# Altium project SmartMCU.PrjPcb
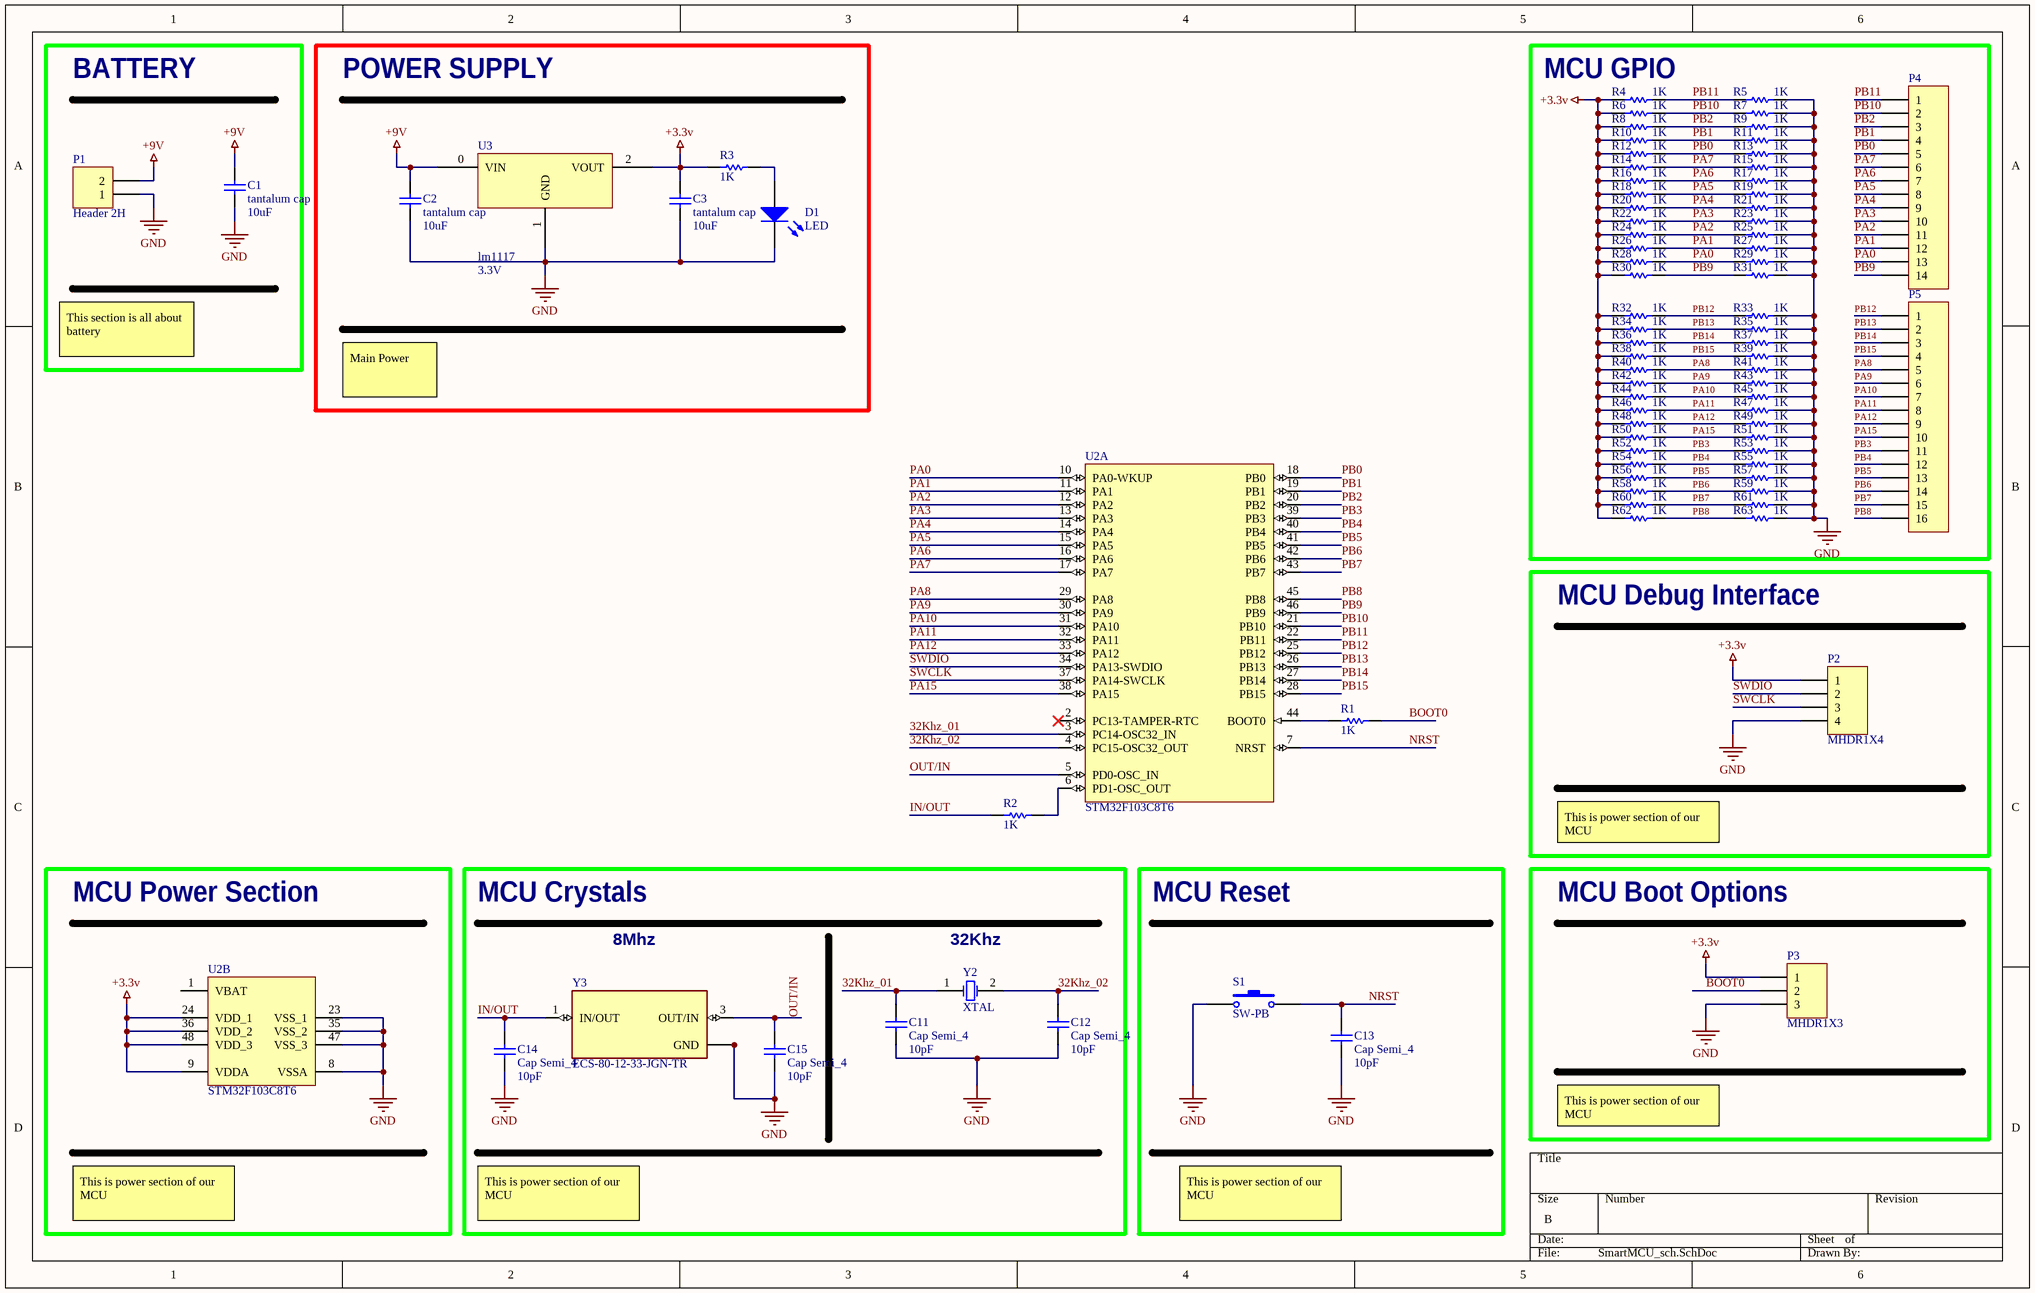
[diagram p0: SmartMCU_sch.SchDoc]

3 sheets, 89 parts. Net scope: global (net labels, ports and power ports of the same name join across sheets).
Board file: SmartMCU_PCB.PcbDoc
Sheets:
  SmartMCU_sch.SchDoc
  MCU.SchDoc
  PowerSupply.SchDoc

## Sheet SmartMCU_sch.SchDoc
size B; SheetNumber: 1; SheetTotal: 3; SPICEModelCacheFSFVQVPL: <root> / <DocumentId>FSFVQVPL</DocumentId> / </root>

### Parts
C1  tantalum cap  value 10uF  [C1206tancap]
C2  tantalum cap  value 10uF  [C1206tancap]
C3  tantalum cap  value 10uF  [C1206tancap]
C11  Cap Semi_4  value 10pF  [0402cap]
C12  Cap Semi_4  value 10pF  [0402cap]
C13  Cap Semi_4  value 10pF  [0402cap]
C14  Cap Semi_4  value 10pF  [0402cap]
C15  Cap Semi_4  value 10pF  [0402cap]
D1  LED  [MY_LED_0805]
P1  Header 2H  [HDR1X2H]
P2  MHDR1X4  [MHDR1X4body]
P3  MHDR1X3  [MHDR1X3body]
P4  Header 14  [My_1X14]  (value not drawn)
P5  Header 16  [My_1X16]  (value not drawn)
R1  1K  [MY_0603]
R2  1K  [MY_0402]
R3  1K  [MY_0805]
R4  1K  [MY_0603]
R5  1K  [MY_0603]
R6  1K  [MY_0603]
R7  1K  [MY_0603]
R8  1K  [MY_0603]
R9  1K  [MY_0603]
R10  1K  [MY_0603]
R11  1K  [MY_0603]
R12  1K  [MY_0603]
R13  1K  [MY_0603]
R14  1K  [MY_0603]
R15  1K  [MY_0603]
R16  1K  [MY_0603]
R17  1K  [MY_0603]
R18  1K  [MY_0603]
R19  1K  [MY_0603]
R20  1K  [MY_0603]
R21  1K  [MY_0603]
R22  1K  [MY_0603]
R23  1K  [MY_0603]
R24  1K  [MY_0603]
R25  1K  [MY_0603]
R26  1K  [MY_0603]
R27  1K  [MY_0603]
R28  1K  [MY_0603]
R29  1K  [MY_0603]
R30  1K  [MY_0603]
R31  1K  [MY_0603]
R32  1K  [MY_0603]
R33  1K  [MY_0603]
R34  1K  [MY_0603]
R35  1K  [MY_0603]
R36  1K  [MY_0603]
R37  1K  [MY_0603]
R38  1K  [MY_0603]
R39  1K  [MY_0603]
R40  1K  [MY_0603]
R41  1K  [MY_0603]
R42  1K  [MY_0603]
R43  1K  [MY_0603]
R44  1K  [MY_0603]
R45  1K  [MY_0603]
R46  1K  [MY_0603]
R47  1K  [MY_0603]
R48  1K  [MY_0603]
R49  1K  [MY_0603]
R50  1K  [MY_0603]
R51  1K  [MY_0603]
R52  1K  [MY_0603]
R53  1K  [MY_0603]
R54  1K  [MY_0603]
R55  1K  [MY_0603]
R56  1K  [MY_0603]
R57  1K  [MY_0603]
R58  1K  [MY_0603]
R59  1K  [MY_0603]
R60  1K  [MY_0603]
R61  1K  [MY_0603]
R62  1K  [MY_0603]
R63  1K  [MY_0603]
S1  SW-PB  [SPST-2_body]
U2  STM32F103C8T6  [STM-LQFP48_L]  (parts A,B of 2)
U3  lm1117  output voltag: 3.3V  [4-Pin SOT]
Y2  XTAL  [32768]
Y3  ECS-80-12-33-JGN-TR  [8MHZCrystall]

### Blocks framed on the sheet
BATTERY: C1 P1
POWER SUPPLY: C2 C3 D1 R3 U3
MCU GPIO: P4 P5 R4-R63
MCU Debug Interface: P2
MCU Power Section: U2
MCU Crystals: C11 C12 C14 C15 Y2 Y3
MCU Reset: C13 S1
MCU Boot Options: P3

### Nets
+3.3v: C3.2 P2.1 P3.1 R3.1 R4.1 R6.1 R8.1 R10.1 R12.1 R14.1 R16.1 R18.1 R20.1 R22.1 R24.1 R26.1 R28.1 R30.1 R32.1 R34.1 R36.1 R38.1 R40.1 R42.1 R44.1 R46.1 R48.1 R50.1 R52.1 R54.1 R56.1 R58.1 R60.1 R62.1 U2.9(VDDA) U2.24(VDD_1) U2.36(VDD_2) U2.48(VDD_3) U3.2(VOUT)
+9V: C1.2 C2.2 P1.2 U3.0(VIN)
GND: C1.1 C2.1 C3.1 C11.2 C12.2 C13.1 C14.2 C15.2 D1.K P1.1 P2.4 P3.3 R5.2 R7.2 R9.2 R11.2 R13.2 R15.2 R17.2 R19.2 R21.2 R23.2 R25.2 R27.2 R29.2 R31.2 R33.2 R35.2 R37.2 R39.2 R41.2 R43.2 R45.2 R47.2 R49.2 R51.2 R53.2 R55.2 R57.2 R59.2 R61.2 R63.2 S1.1 U2.8(VSSA) U2.23(VSS_1) U2.35(VSS_2) U2.47(VSS_3) U3.1(GND) Y3.2(GND) Y3.4(GND)
32Khz_01: C11.1 U2.3(PC14-OSC32_IN) Y2.1(OSC1)
32Khz_02: C12.1 U2.4(PC15-OSC32_OUT) Y2.2(OSC2)
BOOT0: P3.2 R1.2
IN/OUT: C14.1 R2.1 Y3.1(IN/OUT)
NRST: C13.2 S1.2 U2.7(NRST)
OUT/IN: C15.1 U2.5(PD0-OSC_IN) Y3.3(OUT/IN)
PA0: P4.13 R28.2 R29.1 U2.10(PA0-WKUP)
PA1: P4.12 R26.2 R27.1 U2.11(PA1)
PA2: P4.11 R24.2 R25.1 U2.12(PA2)
PA3: P4.10 R22.2 R23.1 U2.13(PA3)
PA4: P4.9 R20.2 R21.1 U2.14(PA4)
PA5: P4.8 R18.2 R19.1 U2.15(PA5)
PA6: P4.7 R16.2 R17.1 U2.16(PA6)
PA7: P4.6 R14.2 R15.1 U2.17(PA7)
PA8: P5.5 R40.2 R41.1 U2.29(PA8)
PA9: P5.6 R42.2 R43.1 U2.30(PA9)
PA10: P5.7 R44.2 R45.1 U2.31(PA10)
PA11: P5.8 R46.2 R47.1 U2.32(PA11)
PA12: P5.9 R48.2 R49.1 U2.33(PA12)
PA15: P5.10 R50.2 R51.1 U2.38(PA15)
PB0: P4.5 R12.2 R13.1 U2.18(PB0)
PB1: P4.4 R10.2 R11.1 U2.19(PB1)
PB2: P4.3 R8.2 R9.1 U2.20(PB2)
PB3: P5.11 R52.2 R53.1 U2.39(PB3)
PB4: P5.12 R54.2 R55.1 U2.40(PB4)
PB5: P5.13 R56.2 R57.1 U2.41(PB5)
PB6: P5.14 R58.2 R59.1 U2.42(PB6)
PB7: P5.15 R60.2 R61.1 U2.43(PB7)
PB8: P5.16 R62.2 R63.1 U2.45(PB8)
PB9: P4.14 R30.2 R31.1 U2.46(PB9)
PB10: P4.2 R6.2 R7.1 U2.21(PB10)
PB11: P4.1 R4.2 R5.1 U2.22(PB11)
PB12: P5.1 R32.2 R33.1 U2.25(PB12)
PB13: P5.2 R34.2 R35.1 U2.26(PB13)
PB14: P5.3 R36.2 R37.1 U2.27(PB14)
PB15: P5.4 R38.2 R39.1 U2.28(PB15)
SWCLK: P2.3 U2.37(PA14-SWCLK)
SWDIO: P2.2 U2.34(PA13-SWDIO)
NetD1_A: D1.A R3.2
NetR1_1: R1.1 U2.44(BOOT0)
NetR2_2: R2.2 U2.6(PD1-OSC_OUT)

Not connected (* = marked no-connect by the designer): U2 1(VBAT) 2(PC13-TAMPER-RTC)*

### Notes on the sheet
- This section is all about battery
- Main Power
- This is power section of our MCU
- 8Mhz
- (near Y2) 32Khz

### Library data of the parts
C1-C3 = Cap Semi_5: Capacitor (Semiconductor SIM Model); Published: 8-Jun-2000; LatestRevisionDate: 29-May-2009; LatestRevisionNote: IPC-7351 Footprint Added.; PackageReference: C1206; Publisher: Altium Limited; PackageDescription: Chip Capacitor
C11-C15 = Cap Semi_4: Capacitor (Semiconductor SIM Model); Published: 8-Jun-2000; LatestRevisionDate: 29-May-2009; LatestRevisionNote: IPC-7351 Footprint Added.; PackageReference: C1206; Publisher: Altium Limited; PackageDescription: Chip Capacitor
D1 = LED: Typical INFRARED GaAs LED; ASiD Part Number: LED-AS
P1 = Header 2H: Header, 2-Pin, Right Angle; Voltage: 9V; LatestRevisionDate: 17-Jul-2002; LatestRevisionNote: Re-released for DXP Platform.; Publisher: Altium Limited
P2 = MHDR1X4: Header, 4-Pin; LatestRevisionDate: 17-Jul-2002; LatestRevisionNote: Re-released for DXP Platform.; Publisher: Altium Limited
P3 = MHDR1X3: Header, 3-Pin; LatestRevisionDate: 17-Jul-2002; LatestRevisionNote: Re-released for DXP Platform.; Publisher: Altium Limited
P4 = Header 14: Header, 14-Pin; ASiD Part Number: Header 14-AS
P5 = Header 16: Header, 16-Pin; ASiD Part Number: Header 16-AS
R1-R63 = Res: Standard resistor; ASiD Part Number: Res-AS; Value: 1K
S1 = SW-PB: Switch; Published: 24-Mar-1999; LatestRevisionDate: 17-Jul-2002; LatestRevisionNote: Re-released for DXP Platform.; PackageReference: SPST-2; Publisher: Altium Limited; PackageDescription: Switch; 2 Leads
U2 = CMP-0237-00215-3: ARM Cortex-M3 32-bit MCU, 64 KB Flash, 20 KB Internal RAM, 37 I/Os, 48-pin LQFP, -40 to 85 degC, Tray; Supply Voltage(Vcc) min (V): 2; Internal RAM Size (kB): 20; FLASH Size (Prog) (kB): 64; A/D Converter: 2x12-bit (10 Channel); I/Os (High Current): 37; Operating Frequency(F) (Processor speed) (MHz): 72; Core: ARM Cortex-M3; ComponentLink3Description: Package Specification; Mounting Technology: Surface Mount; PartNumber: STM32F103C8T6; PackageReference: LQFP48; Packing: Tray; ComponentLink3URL: http://www.st.com/st-web-ui/static/active/en/resource/technical/document/datasheet/DM00058181.pdf; DatasheetVersion: Rev. 16; ComponentLink1URL: http://www.st.com/web/en/home.html; PackageVersion: Rev. 6, 06/2013; ComponentLink2URL: http://www.st.com/st-web-ui/static/active/en/resource/technical/document/datasheet/CD00161566.pdf; ComponentLink1Description: Manufacturer URL; ComponentLink2Description: Datasheet; PackageDescription: 48-Pin Low Profile Quad Flat Package, 7 x 7 mm Body, 0.5 mm Pitch
U3 = lm1117: The LM1117 is a low dropout voltage regulator with a / dropout of 1.2 V at 800 mA of load current. / The LM1117 is available in an adjustable version, / which can set the output voltage from 1.25 to 13.8 V / with only two external resistors. In addition, it is / available in five fixed voltages, 1.8 V, 2.5 V, 3.3 V, / and 5 V. / The LM1117 offers current limiting and thermal / shutdown. Its circuit includes a Zener trimmed / bandgap reference to assure output voltage accuracy / to within ±1%. / A minimum of 10-µF tantalum capacitor is required at / the output to improve the transient response and / stability.; ComponentLink1Description: datasheet; ComponentLink1URL: https://www.ti.com/lit/gpn/lm1117
Y2 = XTAL: Crystal Oscillator; Published: 8-Jun-2000; LatestRevisionDate: 17-Jul-2002; LatestRevisionNote: Re-released for DXP Platform.; PackageReference: R38; Publisher: Altium Limited; PackageDescription: Crystal, Thru-Hole; 2 Leads; Body 3.1 x 8.2 mm (Dia.xH)
Y3 = ECS-80-12-33-JGN-TR: 8MHz Â±20ppm Crystal 12pF 400 Ohms 4-SMD, No Lead; MF: ECS Inc.; Value: *; Package: SMD-4 ECS International; MP: ECS-80-12-33-JGN-TR; Availability: Warning; Price: None; SnapEDA_Link: https://www.snapeda.com/parts/ECS-80-12-33-JGN-TR/ECS%20Inc./view-part/4477300/?ref=snap; Mouser-Purchase-URL: https://snapeda.com/shop?store=Mouser&id=4477300; BuyPart: https://www.snapeda.com/parts/ECS-80-12-33-JGN-TR/ECS%20Inc./view-part/4477300/?ref=eda

## Sheet MCU.SchDoc
size A; SheetNumber: 2; SheetTotal: 3; SPICEModelCacheIZEWMZVA: <root> / <DocumentId>IZEWMZVA</DocumentId> / </root>
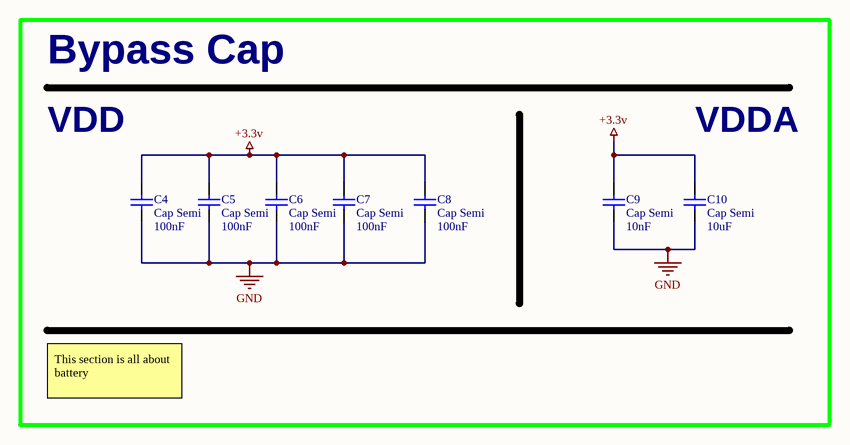
[diagram p1: MCU.SchDoc]

### Parts
C4  Cap Semi  value 100nF  [1608[0603]cap]
C5  Cap Semi  value 100nF  [1608[0603]cap]
C6  Cap Semi  value 100nF  [1608[0603]cap]
C7  Cap Semi  value 100nF  [1608[0603]cap]
C8  Cap Semi  value 100nF  [1608[0603]cap]
C9  Cap Semi  value 10nF  [1608[0603]cap]
C10  Cap Semi  value 10uF  [1608[0603]cap]

### Nets
+3.3v: C4.2 C5.2 C6.2 C7.2 C8.2 C9.2 C10.2
GND: C4.1 C5.1 C6.1 C7.1 C8.1 C9.1 C10.1

### Notes on the sheet
- Bypass Cap
- VDD
- VDDA
- This section is all about battery

### Library data of the parts
C4-C10 = Cap Semi: Capacitor (Semiconductor SIM Model); Published: 8-Jun-2000; LatestRevisionDate: 29-May-2009; LatestRevisionNote: IPC-7351 Footprint Added.; PackageReference: C1206; Publisher: Altium Limited; PackageDescription: Chip Capacitor

## Sheet PowerSupply.SchDoc
size A; SheetNumber: 3; SheetTotal: 3

## Nets that join several sheets
+3.3v: SmartMCU_sch (39 pins), MCU (7 pins)
GND: SmartMCU_sch (50 pins), MCU (7 pins)